# Altium schematic sheet Cheeta_Driver.SchDoc
size A4
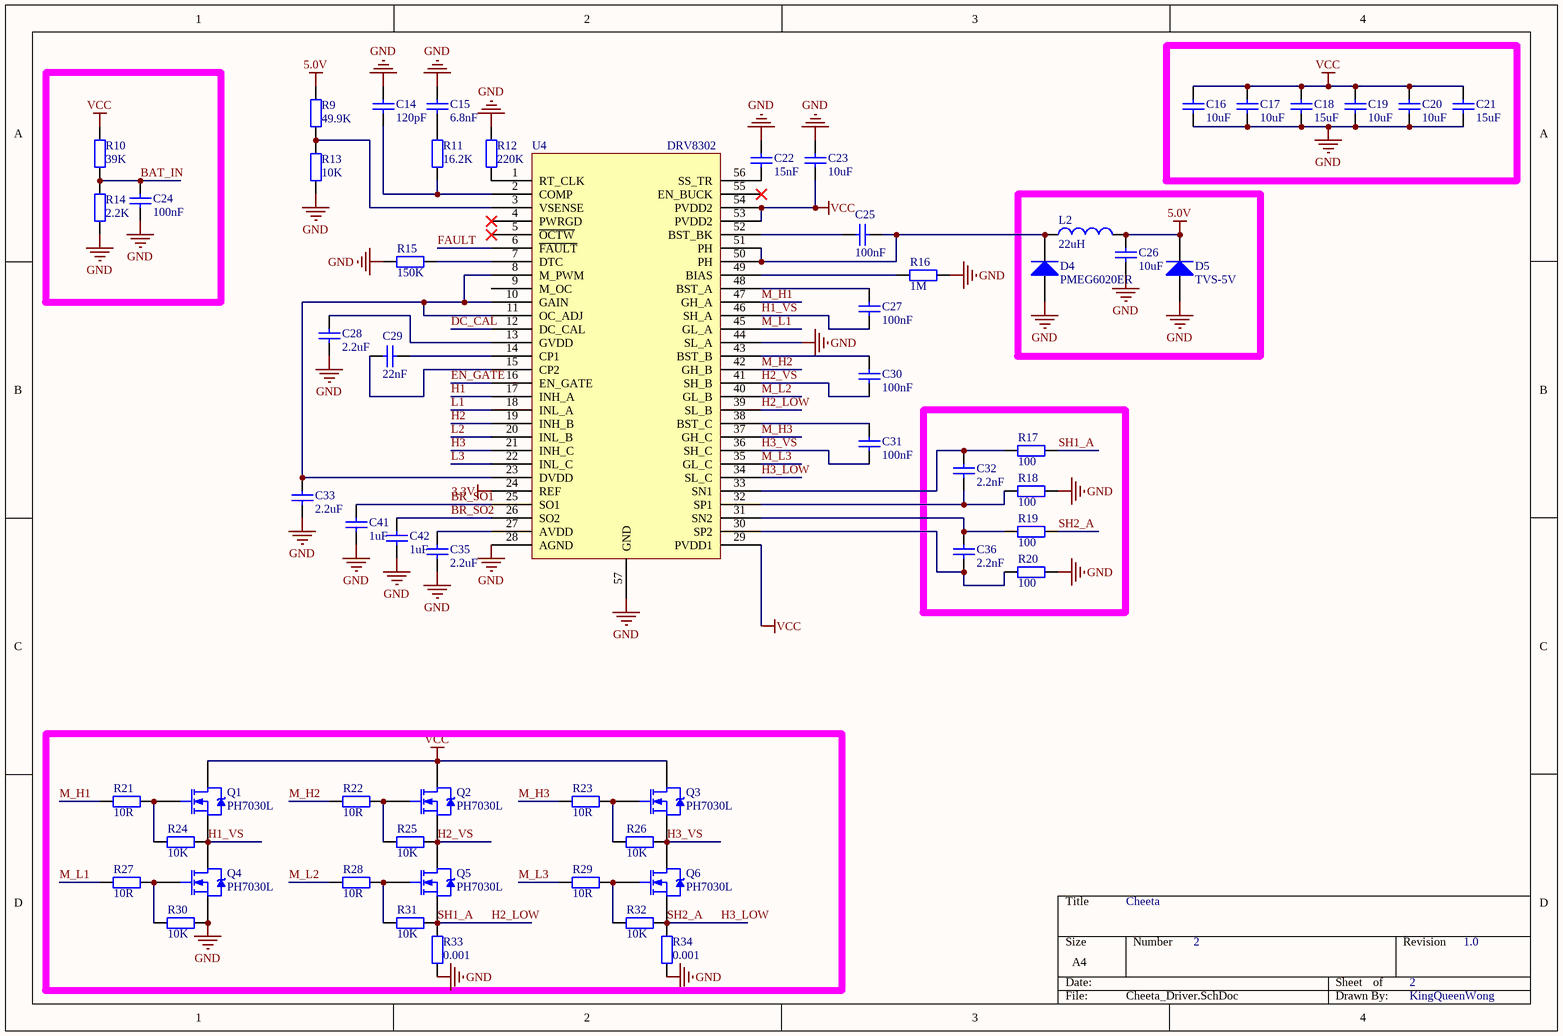
[diagram p0: Cheeta_Driver.SchDoc]

## Parts
C14  value 120pF  [0603C]  (hidden comment: Cap)
C15  value 6.8nF  [0603C]  (hidden comment: Cap)
C16  value 10uF  [C1206]  (hidden comment: Cap)
C17  value 10uF  [C1206]  (hidden comment: Cap)
C18  value 15uF  [2220]  (hidden comment: Cap)
C19  value 10uF  [C1206]  (hidden comment: Cap)
C20  value 10uF  [C1206]  (hidden comment: Cap)
C21  value 15uF  [2220]  (hidden comment: Cap)
C22  value 15nF  [0603C]  (hidden comment: Cap)
C23  value 10uF  [C1206]  (hidden comment: Cap)
C24  value 100nF  [0603C]  (hidden comment: Cap)
C25  value 100nF  [0603C]  (hidden comment: Cap)
C26  value 10uF  [C1210]  (hidden comment: Cap)
C27  value 100nF  [0603C]  (hidden comment: Cap)
C28  value 2.2uF  [0603C]  (hidden comment: Cap)
C29  value 22nF  [0603C]  (hidden comment: Cap)
C30  value 100nF  [0603C]  (hidden comment: Cap)
C31  value 100nF  [0603C]  (hidden comment: Cap)
C32  value 2.2nF  [0603C]  (hidden comment: Cap)
C33  value 2.2uF  [0603C]  (hidden comment: Cap)
C35  value 2.2uF  [0603C]  (hidden comment: Cap)
C36  value 2.2nF  [0603C]  (hidden comment: Cap)
C41  value 1uF  [0603C]  (hidden comment: Cap)
C42  value 1uF  [0603C]  (hidden comment: Cap)
D4  PMEG6020ER  [SMA]
D5  TVS-5V  [SMB]
L2  value 22uH  [CD43]  (hidden comment: Inductor)
Q1  PH7030L  [SOT669]
Q2  PH7030L  [SOT669]
Q3  PH7030L  [SOT669]
Q4  PH7030L  [SOT669]
Q5  PH7030L  [SOT669]
Q6  PH7030L  [SOT669]
R9  value 49.9K  [0603R]  (hidden comment: Res2)
R10  value 39K  [0603R]  (hidden comment: Res2)
R11  value 16.2K  [0603R]  (hidden comment: Res2)
R12  value 220K  [0603R]  (hidden comment: Res2)
R13  value 10K  [0603R]  (hidden comment: Res2)
R14  value 2.2K  [0603R]  (hidden comment: Res2)
R15  value 150K  [0603R]  (hidden comment: Res2)
R16  value 1M  [0603R]  (hidden comment: Res2)
R17  value 100  [0603R]  (hidden comment: Res2)
R18  value 100  [0603R]  (hidden comment: Res2)
R19  value 100  [0603R]  (hidden comment: Res2)
R20  value 100  [0603R]  (hidden comment: Res2)
R21  value 10R  [0603R]  (hidden comment: Res2)
R22  value 10R  [0603R]  (hidden comment: Res2)
R23  value 10R  [0603R]  (hidden comment: Res2)
R24  value 10K  [0603R]  (hidden comment: Res2)
R25  value 10K  [0603R]  (hidden comment: Res2)
R26  value 10K  [0603R]  (hidden comment: Res2)
R27  value 10R  [0603R]  (hidden comment: Res2)
R28  value 10R  [0603R]  (hidden comment: Res2)
R29  value 10R  [0603R]  (hidden comment: Res2)
R30  value 10K  [0603R]  (hidden comment: Res2)
R31  value 10K  [0603R]  (hidden comment: Res2)
R32  value 10K  [0603R]  (hidden comment: Res2)
R33  value 0.001  [2512]  (hidden comment: Res2)
R34  value 0.001  [2512]  (hidden comment: Res2)
U4  DRV8302  [DGG056_L]

## Nets
3.3V: U4.24(REF)
5.0V: C26.1 D5.2(K) L2.2 R9.1
GND: C14.2 C15.2 C16.2 C17.2 C18.2 C19.2 C20.2 C21.2 C22.2 C23.2 C24.1 C26.2 C28.2 C33.1 C35.1 C41.1 C42.1 D4.1(A) D5.1(A) Q4.3(S) R12.1 R13.2 R14.2 R15.1 R16.1 R18.1 R20.1 R30.1 R33.2 R34.1 U4.28(AGND) U4.44(SL_A) U4.57(GND)
VCC: C16.1 C17.1 C18.1 C19.1 C20.1 C21.1 C23.1 Q1.2(D) Q2.2(D) Q3.2(D) R10.1 U4.29(PVDD1) U4.53(PVDD2) U4.54(PVDD2)
BAT_IN: C24.2 R10.2 R14.1
BR_SO1: C41.2 U4.25(SO1)
BR_SO2: C42.2 U4.26(SO2)
DC_CAL: U4.12(DC_CAL)
EN_GATE: U4.16(EN_GATE)
FAULT: U4.6(~{FAULT})
H1: U4.17(INH_A)
H1_VS: C27.2 Q1.3(S) Q4.2(D) R24.1 U4.46(SH_A)
H2: U4.19(INH_B)
H2_LOW: Q5.3(S) R17.1 R31.2 R33.1 U4.39(SL_B)  [also labelled SH1_A]
H2_VS: C30.2 Q2.3(S) Q5.2(D) R25.1 U4.41(SH_B)
H3: U4.21(INH_C)
H3_LOW: Q6.3(S) R19.1 R32.1 R34.2 U4.34(SL_C)  [also labelled SH2_A]
H3_VS: C31.2 Q3.3(S) Q6.2(D) R26.1 U4.36(SH_C)
L1: U4.18(INL_A)
L2: U4.20(INL_B)
L3: U4.22(INL_C)
M_H1: R21.2 U4.47(GH_A)
M_H2: R22.2 U4.42(GH_B)
M_H3: R23.2 U4.37(GH_C)
M_L1: R27.2 U4.45(GL_A)
M_L2: R28.2 U4.40(GL_B)
M_L3: R29.2 U4.35(GL_C)
NetC14_1: C14.1 R11.2 U4.2(COMP)
NetC15_1: C15.1 R11.1
NetC22_1: C22.1 U4.56(SS_TR)
NetC25_1: C25.1 U4.52(BST_BK)
NetC25_2: C25.2 D4.2(K) L2.1 U4.50(PH) U4.51(PH)
NetC27_1: C27.1 U4.48(BST_A)
NetC28_1: C28.1 U4.13(GVDD)
NetC29_1: C29.1 U4.15(CP2)
NetC29_2: C29.2 U4.14(CP1)
NetC30_1: C30.1 U4.43(BST_B)
NetC31_1: C31.1 U4.38(BST_C)
NetC32_1: C32.1 R18.2 U4.32(SP1)
NetC32_2: C32.2 R17.2 U4.33(SN1)
NetC33_2: C33.2 U4.8(M_PWM) U4.10(GAIN) U4.11(OC_ADJ) U4.23(DVDD)
NetC35_2: C35.2 U4.27(AVDD)
NetC36_1: C36.1 R20.2 U4.30(SP2)
NetC36_2: C36.2 R19.2 U4.31(SN2)
NetQ1_1: Q1.1(G) R21.1 R24.2
NetQ2_1: Q2.1(G) R22.1 R25.2
NetQ3_1: Q3.1(G) R23.1 R26.2
NetQ4_1: Q4.1(G) R27.1 R30.2
NetQ5_1: Q5.1(G) R28.1 R31.1
NetQ6_1: Q6.1(G) R29.1 R32.2
NetR9_2: R9.2 R13.1 U4.3(VSENSE)
NetR12_2: R12.2 U4.1(RT_CLK)
NetR15_2: R15.2 U4.7(DTC)
NetR16_2: R16.2 U4.49(BIAS)

Not connected (* = marked no-connect by the designer): U4 4(PWRGD)* 5(~{OCTW})* 9(M_OC) 55(EN_BUCK)*

## Notes on the sheet
- Cheeta
- 2
- 1.0
- KingQueenWong

## Library data of the parts
C14-C33 C35 C36 C41 C42 = Cap: Capacitor; Published: 8-Jun-2000; LatestRevisionDate: 17-Jul-2002; LatestRevisionNote: Re-released for DXP Platform.; PackageReference: RAD-0.3; Publisher: Altium Limited; PackageDescription: Radial Cap, Thru-Hole; 2 Leads; 0.3 in Pin Spacing
D4 D5 = Diode: Default Diode; Published: 8-Jun-2000; LatestRevisionDate: 17-Jul-2002; LatestRevisionNote: Re-released for DXP Platform.; PackageVersion: Sep-1996; PackageReference: SMC; Publisher: Altium Limited; PackageDescription: DO-214-AB/SMC; 2 C-Bend Leads; Body 7.9 x 5.9 mm, inc. leads (LxW); Code_JEDEC: DO-214-AB
L2 = Inductor: Code_IEC: 1005; Published: 8-Jun-2000; LatestRevisionDate: 29-May-2009; LatestRevisionNote: IPC-7351 Footprint Added.; PackageReference: 0402-A; Publisher: Altium Limited; PackageDescription: Chip Inductor; Code_JEITA: 0402
Q1-Q6 = PH7030L: HEXFET Power MOSFET; Published: 17-Sep-2003; LatestRevisionDate: 20-Nov-2009; LatestRevisionNote: IPC-7351 Footprint Added.; DatasheetVersion: 16-Mar-2001; PackageReference: D2PAK; Publisher: Altium Limited; PackageDescription: 3-Pin Transistor Outline Package 2.54 mm Pitch, 15.1 mm Lead Span; ComponentLink1Description: Manufacturer Link; ComponentLink1URL: http://www.irf.com/; ComponentLink2Description: Datasheet; ComponentLink2URL: http://www.irf.com/product-info/datasheets/data/IRFR2405.pdf
R9-R34 = Res2: Resistor; Published: 8-Jun-2000; LatestRevisionDate: 17-Jul-2002; LatestRevisionNote: Re-released for DXP Platform.; PackageReference: AXIAL-0.4; Publisher: Altium Limited; PackageDescription: Axial Device, Thru-Hole; 2 Leads; 0.4 in Pin Spacing